# Altium schematic sheet INA240_Breakout.SchDoc: Inline Current Sense
size A4; Author: Chawthri K.; Organization: Waterloop; Address1: 200 University Ave W; Address2: Engineering 5, 1104; Address3: Waterloo, ON; Address4: N2L 3G1; Revision: 0; SheetNumber: 1; SheetTotal: 1
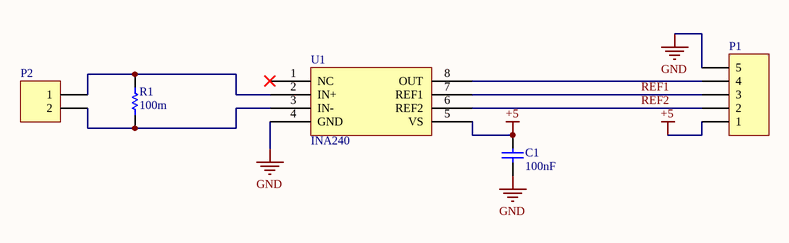
[diagram p0: INA240_Breakout.SchDoc]

## Parts
C1  value 100nF  [0805 - Capacitor]  (hidden comment: Capacitor - Nonpolarized)
P1  1x5 Header  [HDR1X5]  (value not drawn)
P2  1x2 Header  [HDR1X2]  (value not drawn)
R1  value 100m  [0805 - Resistor]  (hidden comment: Resistor)
U1  INA240  [INA240]

## Nets
+5: C1.2 P1.1 U1.5(VS)
GND: C1.1 P1.5 U1.4(GND)
REF1: P1.3 U1.7(REF1)
REF2: P1.2 U1.6(REF2)
NetP1_4: P1.4 U1.8(OUT)
NetP2_1: P2.1 R1.1 U1.2(IN+)
NetP2_2: P2.2 R1.2 U1.3(IN-)

Not connected (* = marked no-connect by the designer): U1 1(NC)*

## Notes on the sheet
- Title:
- Size:
- Date:
- A4
- Author:
- Revision:
- Sheet
- of
- File:

## Library data of the parts
C1 = Capacitor - Nonpolarized: Nonpolarized Capacitor; Manufacturer: Yageo; Manufacturer Part Number: CC0805KRX7R9BB104; Supplier Part Number: 311-1140-1-ND; Supplier: *; Rating: *
P1 = 1x5 Header: 1x5 Pin Header
P2 = 1x2 Header: 1x2 Pin Header
R1 = Resistor: Manufacturer Part Number: 73L3R10J; Manufacturer: CTS; Rating: *; Supplier Part Number: 73L3R10JCT-ND; Supplier: *
U1 = INA240: -4V to 80V Current Sense Amplifier; Manufacturer: Texas Instruments; Manufacturer Part Number: INA240A2DR; Datasheet: https://www.ti.com/lit/ds/sbos662b/sbos662b.pdf; Digikey Part Number: 296-51173-1-ND